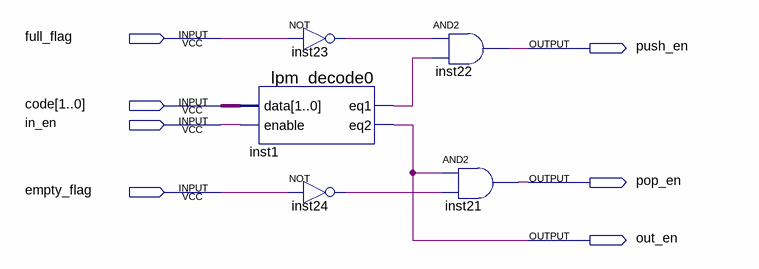
[diagram p0: schematic sheet]
// Quartus schematic stack_controller.bdf as structural Verilog: 5 symbols, 7 pins
module stack_controller (
  input  full_flag,
  input  [1:0] code,
  input  in_en,
  input  empty_flag,
  output push_en,
  output pop_en,
  output out_en
);

  wire inst1_eq1, inst23_out, inst24_out;

  lpm_decode0 inst1 (.data(code), .enable(in_en), .eq1(inst1_eq1), .eq2(out_en));
  not inst23 (inst23_out, full_flag);
  not inst24 (inst24_out, empty_flag);
  and inst22 (push_en, inst23_out, inst1_eq1);
  and inst21 (pop_en, out_en, inst24_out);
endmodule
